# Altium schematic sheet Input.SchDoc
size A4
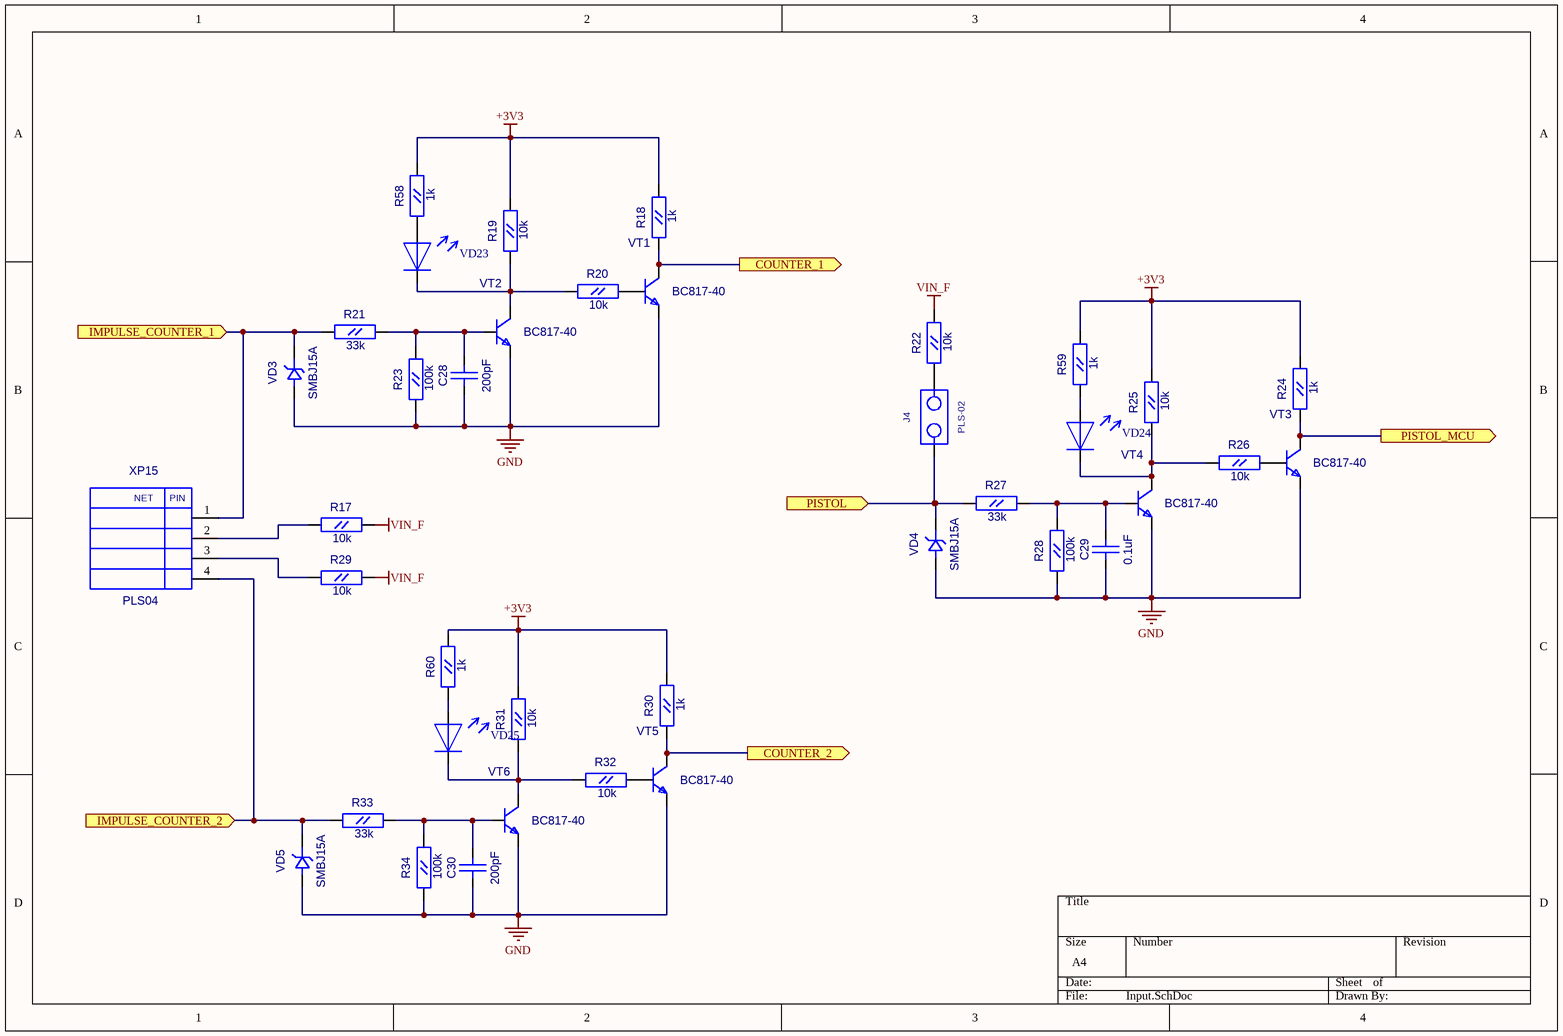
[diagram p0: Input.SchDoc]

## Parts
C28  200pF  [CC0603]
C29  0.1uF  [CC0603]
C30  200pF  [CC0603]
J4  PLS-02  [PLS-02]
R17  10k  [RC0603]
R18  1k  [RC0603]
R19  10k  [RC0603]
R20  10k  [RC0603]
R21  33k  [RC0603]
R22  10k  [RC0603]
R23  100k  [RC0603]
R24  1k  [RC0603]
R25  10k  [RC0603]
R26  10k  [RC0603]
R27  33k  [RC0603]
R28  100k  [RC0603]
R29  10k  [RC0603]
R30  1k  [RC0603]
R31  10k  [RC0603]
R32  10k  [RC0603]
R33  33k  [RC0603]
R34  100k  [RC0603]
R58  1k  [RC0603]
R59  1k  [RC0603]
R60  1k  [RC0603]
VD3  SMBJ15A  [SMB]
VD4  SMBJ15A  [SMB]
VD5  SMBJ15A  [SMB]
VD23  LED_0805  [LED0805]  (value not drawn)
VD24  LED_0805  [LED0805]  (value not drawn)
VD25  LED_0805  [LED0805]  (value not drawn)
VT1  BC817-40  [SOT-23(123)]
VT2  BC817-40  [SOT-23(123)]
VT3  BC817-40  [SOT-23(123)]
VT4  BC817-40  [SOT-23(123)]
VT5  BC817-40  [SOT-23(123)]
VT6  BC817-40  [SOT-23(123)]
XP15  PLS04  [PIN04S]

## Ports
COUNTER_1 (out), COUNTER_2 (out), IMPULSE_COUNTER_1 (in), IMPULSE_COUNTER_2 (in), PISTOL (in), PISTOL_MCU (out)

## Nets
+3V3: R18.2(B) R19.2(B) R24.2(B) R25.2(B) R30.2(B) R31.2(B) R58.2(B) R59.2(B) R60.2(B)
GND: C28.1(A) C29.1(A) C30.1(A) R23.1(A) R28.1(A) R34.1(A) VD3.1(A) VD4.1(A) VD5.1(A) VT1.2(E) VT2.2(E) VT3.2(E) VT4.2(E) VT5.2(E) VT6.2(E)
VIN_F: R17.2(B) R22.2(B) R29.2(B)
COUNTER_1: R18.1(A) VT1.3(C) ; port COUNTER_1
COUNTER_2: R30.1(A) VT5.3(C) ; port COUNTER_2
IMPULSE_COUNTER_1: R21.1(A) VD3.2(K) XP15.1 ; port IMPULSE_COUNTER_1
IMPULSE_COUNTER_2: R33.1(A) VD5.2(K) XP15.4 ; port IMPULSE_COUNTER_2
PISTOL: J4.1 R27.1(A) VD4.2(K) ; port PISTOL
PISTOL_MCU: R24.1(A) VT3.3(C) ; port PISTOL_MCU
NetC28_2: C28.2(B) R21.2(B) R23.2(B) VT2.1(B)
NetC29_2: C29.2(B) R27.2(B) R28.2(B) VT4.1(B)
NetC30_2: C30.2(B) R33.2(B) R34.2(B) VT6.1(B)
NetJ4_2: J4.2 R22.1(A)
NetR17_1: R17.1(A) XP15.2
NetR19_1: R19.1(A) R20.1(A) VD23.2 VT2.3(C)
NetR20_2: R20.2(B) VT1.1(B)
NetR25_1: R25.1(A) R26.1(A) VD24.2 VT4.3(C)
NetR26_2: R26.2(B) VT3.1(B)
NetR29_1: R29.1(A) XP15.3
NetR31_1: R31.1(A) R32.1(A) VD25.2 VT6.3(C)
NetR32_2: R32.2(B) VT5.1(B)
NetR58_1: R58.1(A) VD23.1
NetR59_1: R59.1(A) VD24.1
NetR60_1: R60.1(A) VD25.1

## Notes on the sheet
- (in symbol PLS04) NET; PIN

## Library data of the parts
C28-C30 = CC0603
  C28 C30: Value: 200pF
  C29: Value: 0.1uF
R17-R34 R58-R60 = RC0603
  R17 R19 R20 R22 R25 R26 R29 R31 R32: Value: 10k
  R18 R24 R30 R58-R60: Value: 1k
  R21 R27 R33: Value: 33k
  R23 R28 R34: Value: 100k
VD3-VD5 = SMBJ: Value: SMBJ15A
VT1-VT6 = BC846BLT1: NPN 500ma transistor; ComponentField7: Published 29-Sep-2000; OriginalName: BC846BLT1; Value: BC817-40
J4 = PLS-02: Value: *
VD23-VD25 = LED_0805: Value: LED_0805
XP15 = PLS04: Value: *